# EAGLE design P2H-001 (EAGLE 7.1.0)
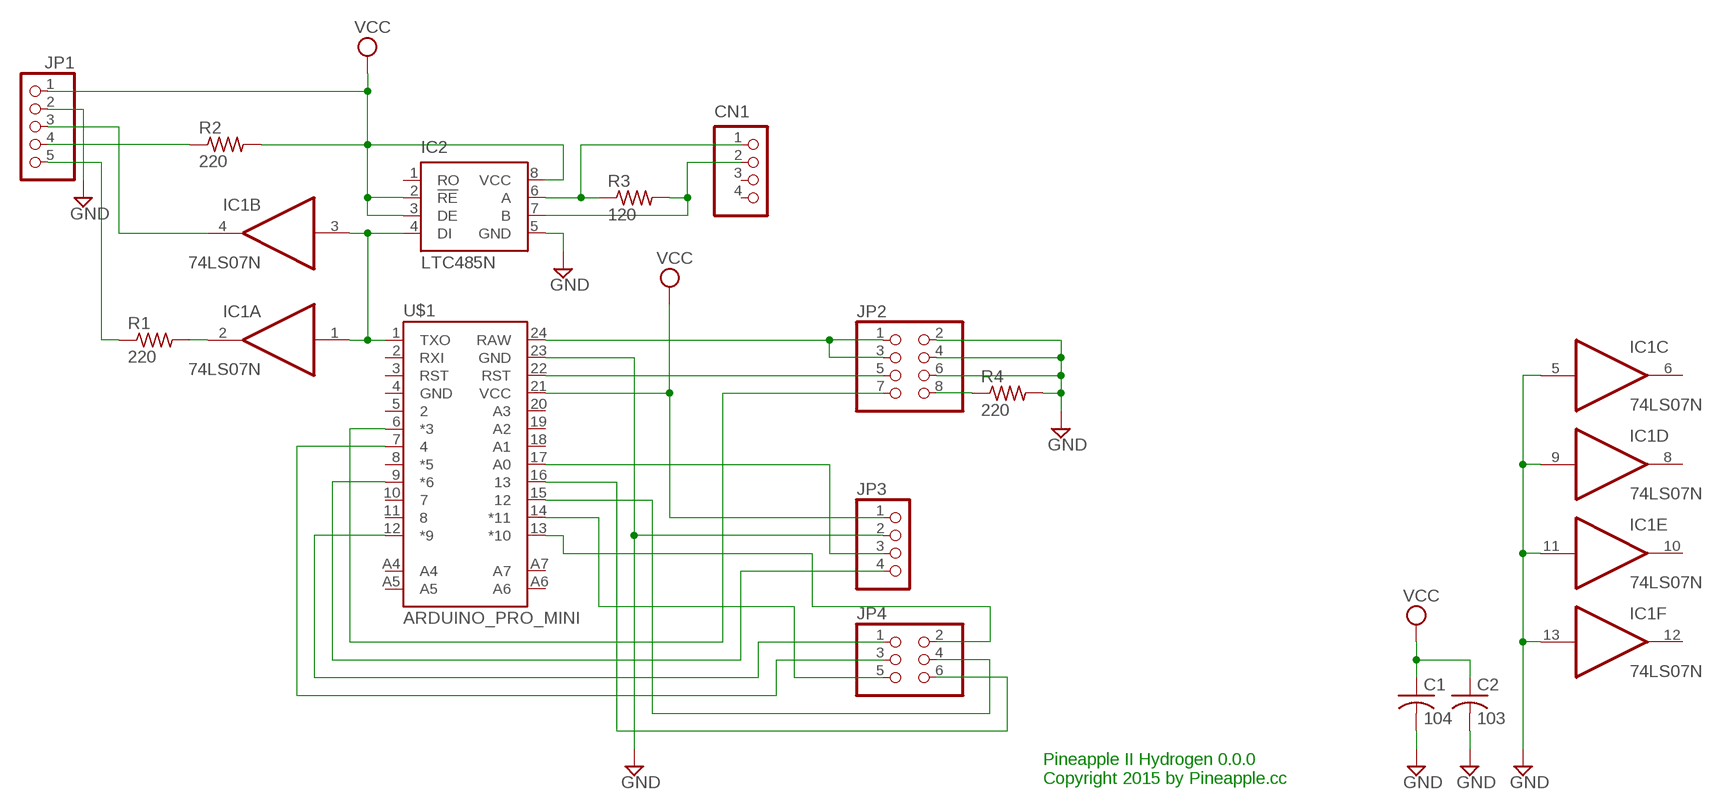
[diagram p0: schematic, sheet 1]

## Parts
C1  104  C-US025-025X050  [C025-025X050]
C2  103  C-US025-025X050  [C025-025X050]
CN1  S4B-PH-K-S  [S4B-PH-K-S]
IC1  74LS07N  [DIL14]
IC2  LTC485N  [DIL08]
JP1  PINHD-1X5  [1X05]
JP2  PINHD-2X4  [2X04]
JP3  PINHD-1X4  [1X04]
JP4  PINHD-2X3  [2X03]
R1  220  R-US_0204/5  [0204/5]
R2  220  R-US_0204/5  [0204/5]
R3  120  R-US_0204/5  [0204/5]
R4  220  R-US_0204/5  [0204/5]
U$1  ARDUINO_PRO_MINI  [ARDUINO_PRO_MINI]

## Nets
GND: C1.2 C2.2 IC1.5(C:I) IC1.9(D:I) IC1.11(E:I) IC1.13(F:I) IC2.5(GND) JP1.2 JP2.2 JP2.4 JP2.6 JP3.2 R4.2 U$1.23(GND)
N$1: IC1.1(A:I) IC1.3(B:I) IC2.4(DI) U$1.1(TXO)
N$2: IC1.2(A:O) R1.2
N$3: JP1.4 R2.1
N$4: IC1.4(B:O) JP1.3
N$5: JP2.8 R4.1
N$6: JP2.5 U$1.22(RST)
N$7: JP1.5 R1.1
N$8: JP2.7 U$1.6(*3)
N$9: JP2.1 JP2.3 U$1.24(RAW)
N$10: JP3.3 U$1.17(A0)
N$11: JP3.4 U$1.9(*6)
N$12: JP4.1 U$1.12(*9)
N$13: JP4.2 U$1.13(*10)
N$14: JP4.3 U$1.7
N$15: JP4.4 U$1.15
N$16: JP4.5 U$1.14(*11)
N$17: JP4.6 U$1.16
N$18: CN1.1 IC2.6(A) R3.1
N$19: CN1.2 IC2.7(B) R3.2
VCC: C1.1 C2.1 IC2.2(!RE) IC2.3(DE) IC2.8(VCC) JP1.1 JP3.1 R2.2 U$1.21(VCC)
Unconnected: CN1.3 CN1.4 IC1.6(C:O) IC1.8(D:O) IC1.10(E:O) IC1.12(F:O) IC2.1(RO) U$1.2(RXI) U$1.3(RST) U$1.4(GND) U$1.5 U$1.8(*5) U$1.10 U$1.11 U$1.18(A1) U$1.19(A2) U$1.20(A3) U$1.A4 U$1.A5 U$1.A6 U$1.A7

## Notes on the sheet
- Pineapple II Hydrogen 0.0.0
  Copyright 2015 by Pineapple.cc

## Power pins joined to a net without a drawn wire
GND: IC1.7(P:GND)
VCC: IC1.14(P:VCC)

## Library data of the parts
C1 C2 = rcl:C-US: CAPACITOR, American symbol
CN1 = jst-ph:S4B-PH-*: Wire-to-Board 2.0mm pitch side mount connector Source: http://www.jst-mfg.com/product/pdf/jpn/PH.pdf http://www.jst-mfg.com/product/detail.php?series=199
IC1 = 74xx-us:74*07: Hex BUFFER, open collector high-voltage output
IC2 = linear-technology:LTC485: Low Power RS485 Interface Transceiver Source: http://www.linear.com/pc/downloadDocument.do?navId=H0,C1,C1007,C1017,P2064,D1718; OC_FARNELL: unknown; OC_NEWARK: unknown
JP1 = pinhead:PINHD-1X5: PIN HEADER
JP2 = pinhead:PINHD-2X4: PIN HEADER
JP3 = pinhead:PINHD-1X4: PIN HEADER
JP4 = pinhead:PINHD-2X3: PIN HEADER
R1-R4 = resistor:R-US_: RESISTOR, American symbol
U$1 = SparkFun-Boards:ARDUINO_PRO_MINI

## Board
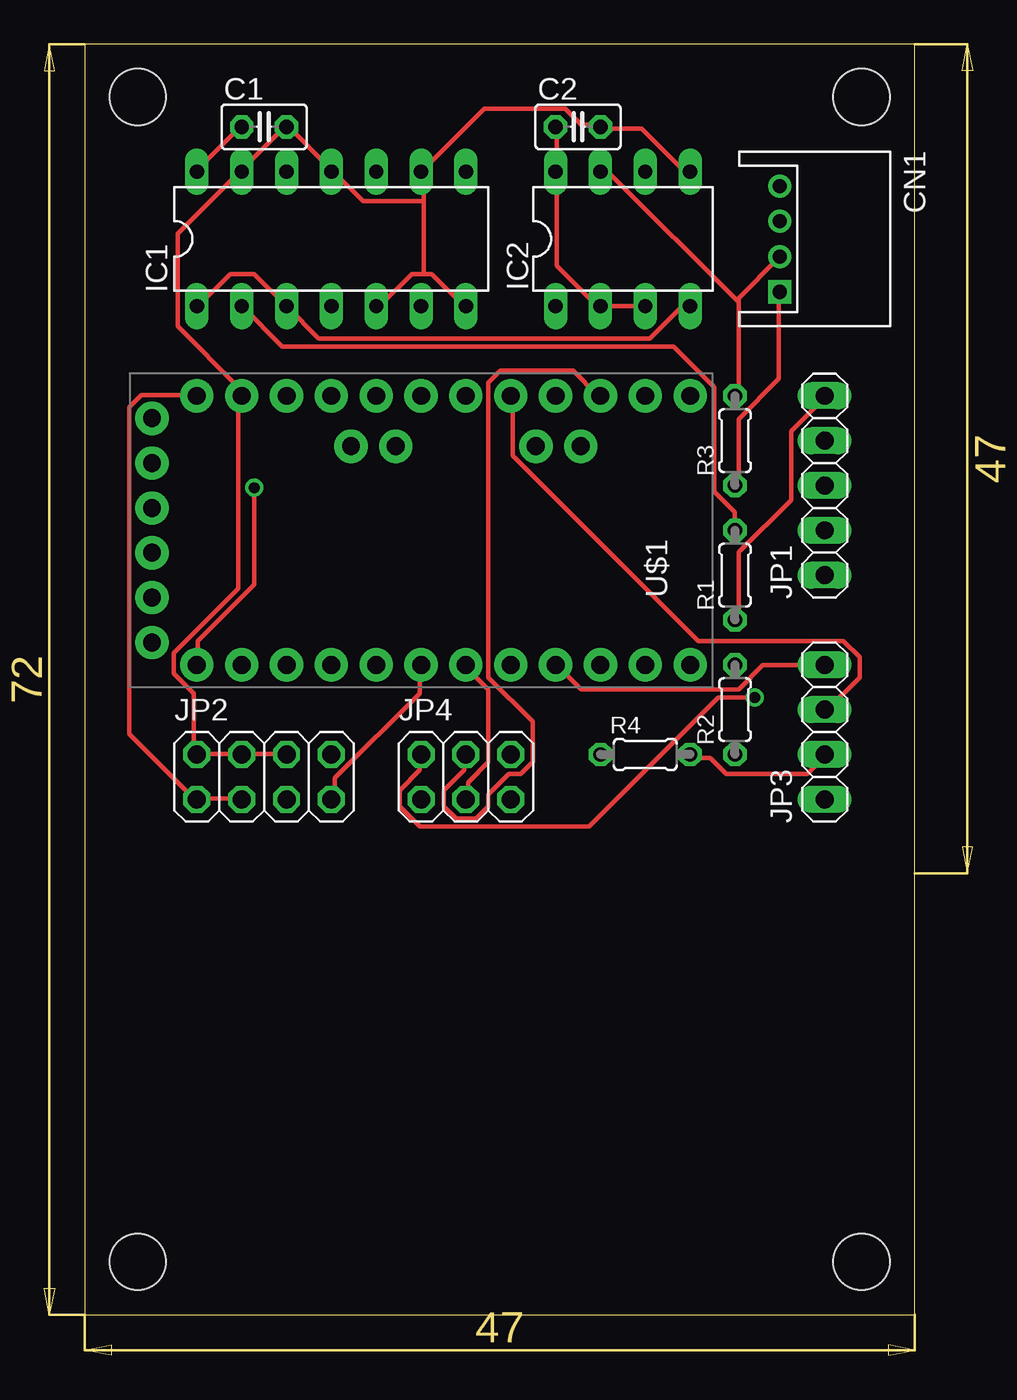
[diagram p1: board, top side]
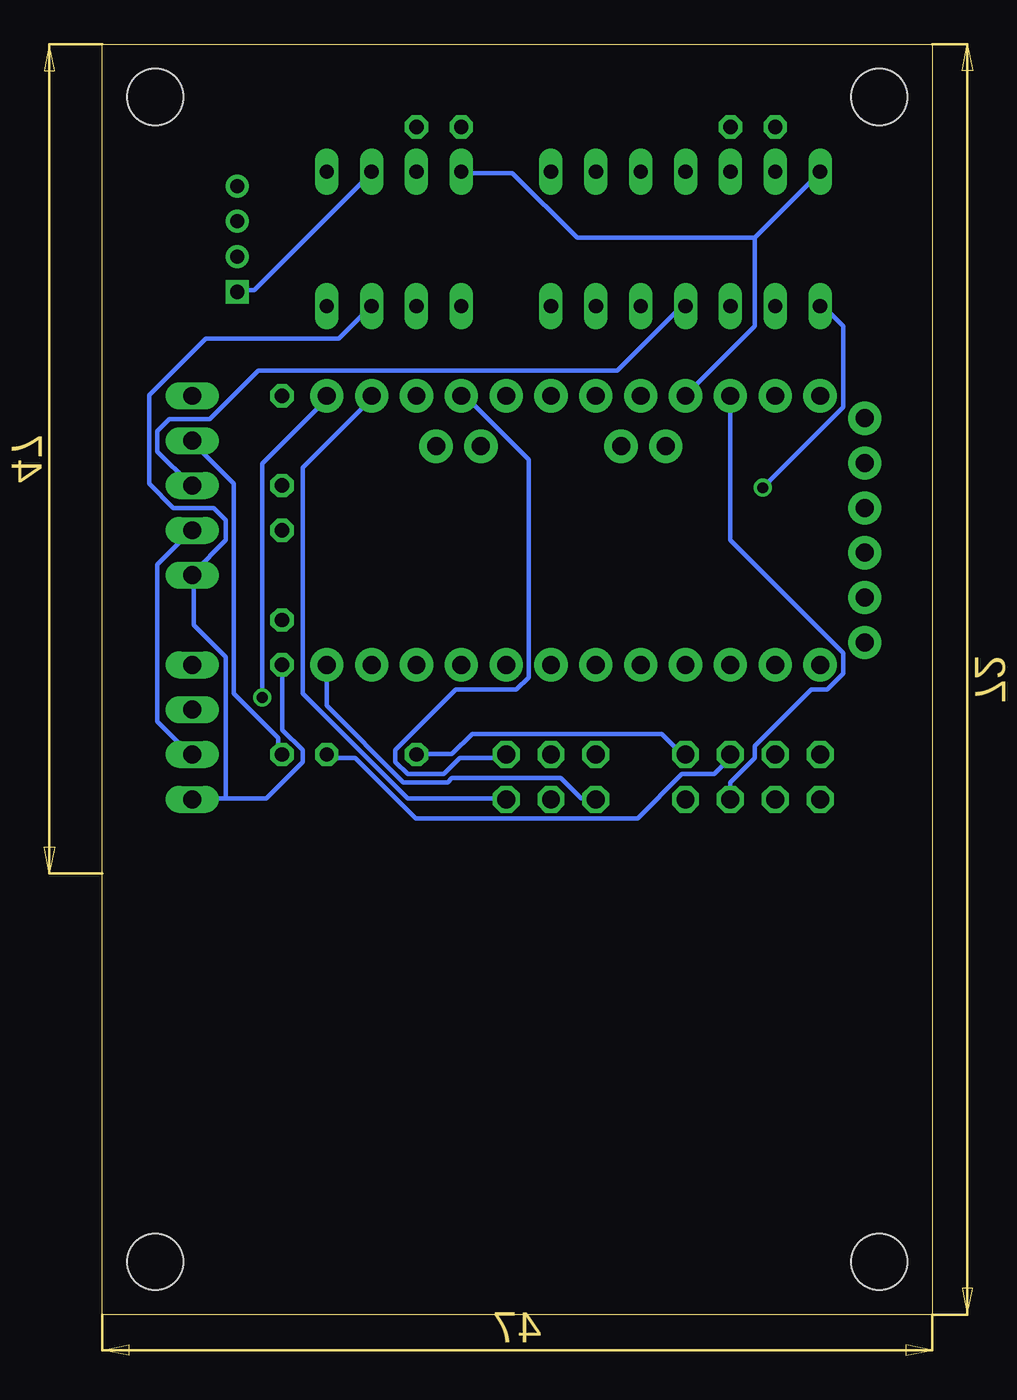
[diagram p2: board, bottom side, seen from below]

Size 47 x 72 mm. Coordinates in mm from the lower left corner, seen from the top.
Outline: 0,0 47,0 47,72 0,72 0,0
Copper layers (1*16): Top 0.035mm / dielectric 1.5mm / Bottom 0.035mm
Design rules "default": minimum track width 10mil, minimum drill 24mil, track to track 8mil, track to pad 8mil, pad to pad 8mil, via to via 8mil, smd to smd 8mil, copper to edge 40mil, drill to drill 8mil, minimum pad ring 10mil, minimum via ring 8mil, stop-mask expansion 4mil, vias tented up to drill 0mil, thermal gap 10mil
Holes 3.2 mm at 3,3 3,69 44,3 44,69

### Footprints (pad centres in the part's own frame; a part is rotated, then mirrored left to right if it is on the bottom)
C025-025X050 = drill 0.813 octagon: 1 -1.27,0; 2 1.27,0
S4B-PH-K-S = drill 0.8 square: 1 3,0 | drill 0.8: 2 1,0; 3 -1,0; 4 -3,0
DIL14 = drill 0.813 long: 1 -7.62,-3.81; 2 -5.08,-3.81; 3 -2.54,-3.81; 4 0,-3.81; 5 2.54,-3.81; 6 5.08,-3.81; 7 7.62,-3.81; 8 7.62,3.81; 9 5.08,3.81; 10 2.54,3.81; 11 0,3.81; 12 -2.54,3.81; 13 -5.08,3.81; 14 -7.62,3.81
DIL08 = drill 0.813 long: 1 -3.81,-3.81; 2 -1.27,-3.81; 3 1.27,-3.81; 4 3.81,-3.81; 5 3.81,3.81; 6 1.27,3.81; 7 -1.27,3.81; 8 -3.81,3.81
1X05 = drill 1.016 long: 1 -5.08,0; 2 -2.54,0; 3 0,0; 4 2.54,0; 5 5.08,0
2X04 = drill 1.016 octagon: 1 -3.81,-1.27; 2 -3.81,1.27; 3 -1.27,-1.27; 4 -1.27,1.27; 5 1.27,-1.27; 6 1.27,1.27; 7 3.81,-1.27; 8 3.81,1.27
1X04 = drill 1.016 long: 1 -3.81,0; 2 -1.27,0; 3 1.27,0; 4 3.81,0
2X03 = drill 1.016 octagon: 1 -2.54,-1.27; 2 -2.54,1.27; 3 0,-1.27; 4 0,1.27; 5 2.54,-1.27; 6 2.54,1.27
0204/5 = drill 0.813 octagon: 1 -2.54,0; 2 2.54,0
ARDUINO_PRO_MINI = drill 1.016 pad 1.88: 1 -7.62,12.7; 2 -7.62,10.16; 3 -7.62,7.62; 4 -7.62,5.08; 5 -7.62,2.54; 6 -7.62,0; 7 -7.62,-2.54; 8 -7.62,-5.08; 9 -7.62,-7.62; 10 -7.62,-10.16; 11 -7.62,-12.7; 12 -7.62,-15.24; 13 7.62,-15.24; 14 7.62,-12.7; 15 7.62,-10.16; 16 7.62,-7.62; 17 7.62,-5.08; 18 7.62,-2.54; 19 7.62,0; 20 7.62,2.54; 21 7.62,5.08; 22 7.62,7.62; 23 7.62,10.16; 24 7.62,12.7; A4 4.763,1.429; A5 4.763,3.969; A6 4.763,-9.049; A7 4.763,-6.509; BLK -6.35,15.24; GND -3.81,15.24; GRN 6.35,15.24; RXI 1.27,15.24; TXO 3.81,15.24; VCC -1.27,15.24

### Placement (x,y rotation side)
C1  10.16,67.31 0 top
C2  27.94,67.31 0 top
CN1  39.37,60.96 270 top
IC1  13.97,60.96 0 top
IC2  30.48,60.96 0 top
JP1  41.91,46.99 90 top
JP2  10.16,30.48 0 top
JP3  41.91,33.02 90 top
JP4  21.59,30.48 0 top
R1  36.83,41.91 90 top
R2  36.83,34.29 90 top
R3  36.83,49.53 90 top
R4  31.75,31.75 0 top
U$1  19.05,44.45 90 top

### Tracks (layer width: path | path; a pad name or v marks a point on that pad's centre or on a via)
GND
  Top 0.254: IC2.5 34.29,64.92 33.83,64.92 31.55,67.21 29.26,67.21 C2.2 29.03,67.44 28.12,67.44 27.2,68.35 22.63,68.35 IC1.9 19.2,64.69 19.2,63.09 | 19.2,58.98 19.66,58.98 21.49,57.15 IC1.7 | 19.2,58.98 18.52,58.98 16.69,57.15 IC1.5 | 19.2,58.98 19.2,63.09 | R4.2 34.29,31.55 35.43,31.55 36.35,30.63 40.92,30.63 41.83,31.55 JP3.2 | JP2.6 11.43,31.77 8.91,31.77 JP2.4 8.69,31.77 6.4,31.77 JP2.2 6.17,31.77 6.17,35.2 5.03,36.35 5.03,37.49 8.69,41.15 8.69,51.89 U$1.23 8.69,52.12 8.69,52.58 5.26,56.01 5.26,61.27 8.69,64.69 IC1.13 8.91,64.92 11.43,67.44 | 11.43,67.44 13.95,64.92 IC1.11 14.17,64.69 15.77,63.09 19.2,63.09 | 11.43,67.44 C1.2
  Bottom 0.254: JP1.2 42.06,44.35 43.89,42.52 43.89,33.6 42.06,31.77 JP3.2 | R4.2 34.29,31.55 32.69,31.55 29.26,28.12 16.69,28.12 14.17,30.63 12.34,30.63 11.43,31.55 JP2.6
N$1  (via drill 0.61)
  Top 0.254: IC1.1 6.4,57.15 8.23,58.98 9.6,58.98 IC1.3 13.26,55.32 32,55.32 33.83,57.15 IC2.4 | v9.6,46.86 9.6,41.38 6.4,38.18 6.4,37.03 U$1.1
  Bottom 0.254: v9.6,46.86 5.03,51.44 5.03,56.01 6.17,57.15 IC1.1
N$2
  Top 0.254: R1.2 36.8,44.58 36.8,45.49 35.66,46.63 35.66,52.58 33.38,54.86 11.2,54.86 8.91,57.15 IC1.2
N$3
  Bottom 0.254: R2.1 37.03,31.77 37.03,32.69 39.55,35.2 39.55,47.09 41.83,49.38 JP1.4
N$4
  Bottom 0.254: IC1.4 14.17,57.15 17.83,53.49 38.18,53.49 40.92,50.75 43.2,50.75 43.89,50.06 43.89,48.92 42.06,47.09 JP1.3
N$5
  Bottom 0.254: R4.1 29.03,31.77 27.2,31.77 26.06,32.92 15.32,32.92 14.17,31.77 JP2.8
N$6
  Bottom 0.254: JP2.5 11.43,30.18 10.06,31.55 10.06,32.23 6.86,35.43 5.94,35.43 5.03,36.35 5.03,37.49 11.43,43.89 U$1.22
N$7
  Top 0.254: R1.1 37.03,39.55 37.03,43.2 40.01,46.18 40.01,50.06 41.83,51.89 JP1.5
N$8
  Top 0.254: JP2.7 14.17,29.26 14.17,30.4 18.97,35.2 18.97,36.8 U$1.6
N$9
  Top 0.254: JP2.3 8.69,29.26 6.4,29.26 JP2.1 6.17,29.26 2.52,32.92 2.52,51.44 3.2,52.12 6.17,52.12 U$1.24
N$10
  Top 0.254: JP3.3 42.06,34.29 43.89,36.12 43.89,37.26 42.98,38.18 34.75,38.18 24.23,48.69 24.23,51.89 U$1.17
N$11
  Top 0.254: JP3.4 41.83,36.8 38.41,36.8 37.03,35.43 28.12,35.43 26.75,36.8 U$1.9
N$12
  Bottom 0.254: U$1.12 34.29,34.52 29.95,30.18 27.43,30.18 27.2,30.4 21.03,30.4 19.89,29.26 19.2,29.26 JP4.1
N$13  (via drill 0.61)
  Top 0.254: v37.95,34.98 35.89,34.98 28.57,27.66 18.97,27.66 17.83,28.8 17.83,29.72 18.97,30.86 18.97,31.55 JP4.2
  Bottom 0.254: v37.95,34.98 37.95,48.23 34.29,51.89 U$1.13
N$14
  Top 0.254: JP4.3 21.72,29.26 21.72,30.18 22.86,31.32 22.86,35.43 21.49,36.8 U$1.7
N$15
  Top 0.254: JP4.4 21.49,31.55 21.49,30.86 20.34,29.72 20.34,28.8 21.03,28.12 22.17,28.12 22.86,28.8 22.86,29.49 24,30.63 24.69,30.63 25.38,31.32 25.38,33.6 22.86,36.12 22.86,52.81 23.55,53.49 27.66,53.49 29.03,52.12 U$1.15
N$16
  Bottom 0.254: JP4.5 24.23,29.26 29.72,29.26 35.66,35.2 35.66,48.01 31.77,51.89 U$1.14
N$17
  Bottom 0.254: JP4.6 24.23,31.55 26.75,31.55 27.66,30.63 29.72,30.63 30.4,31.32 30.4,32 26.98,35.43 23.55,35.43 22.86,36.12 22.86,48.46 26.52,52.12 U$1.16
N$18
  Top 0.254: R3.1 37.03,47.09 37.03,50.75 39.32,53.03 39.32,57.84 CN1.1
  Bottom 0.254: CN1.1 39.32,58.06 38.41,58.06 31.77,64.69 IC2.6
N$19
  Top 0.254: 37.03,57.38 37.03,52.12 R3.2 | 37.03,57.38 37.03,57.61 39.32,59.89 CN1.2 | 37.03,57.38 29.72,64.69 29.26,64.69 IC2.7
VCC
  Top 0.254: C2.1 26.75,67.21 26.75,64.92 IC2.8 26.75,64.69 26.75,59.44 29.03,57.15 IC2.2 IC2.3 | IC1.14 6.4,64.92 8.69,67.21 C1.1
  Bottom 0.254: 40.01,29.26 41.83,29.26 JP3.1 | 40.01,29.26 37.72,29.26 35.66,31.32 35.66,32 36.8,33.15 36.8,36.8 R2.2 | 40.01,29.26 40.01,37.26 41.83,39.09 41.83,41.83 JP1.1 41.83,42.06 40.01,43.89 40.01,45.03 40.69,45.72 42.98,45.72 44.35,47.09 44.35,52.12 41.15,55.32 33.6,55.32 31.77,57.15 IC2.3 | 10.06,61.04 10.06,56.01 13.95,52.12 U$1.21 | 10.06,61.04 6.4,64.69 IC1.14 | 10.06,61.04 20.12,61.04 23.77,64.69 26.52,64.69 IC2.8

### Text on the board
Document: PINEAPPLE II HYDROGEN / REVISION 1.0.0 (2015)